# EasyEDA schematic SCH_esp_charge_normal.json
TITLE: Sheet_1; REV: 1.0; Date: 2022-09-16; Sheet: 1/1; Drawn By: elanworld; Company: Your Company
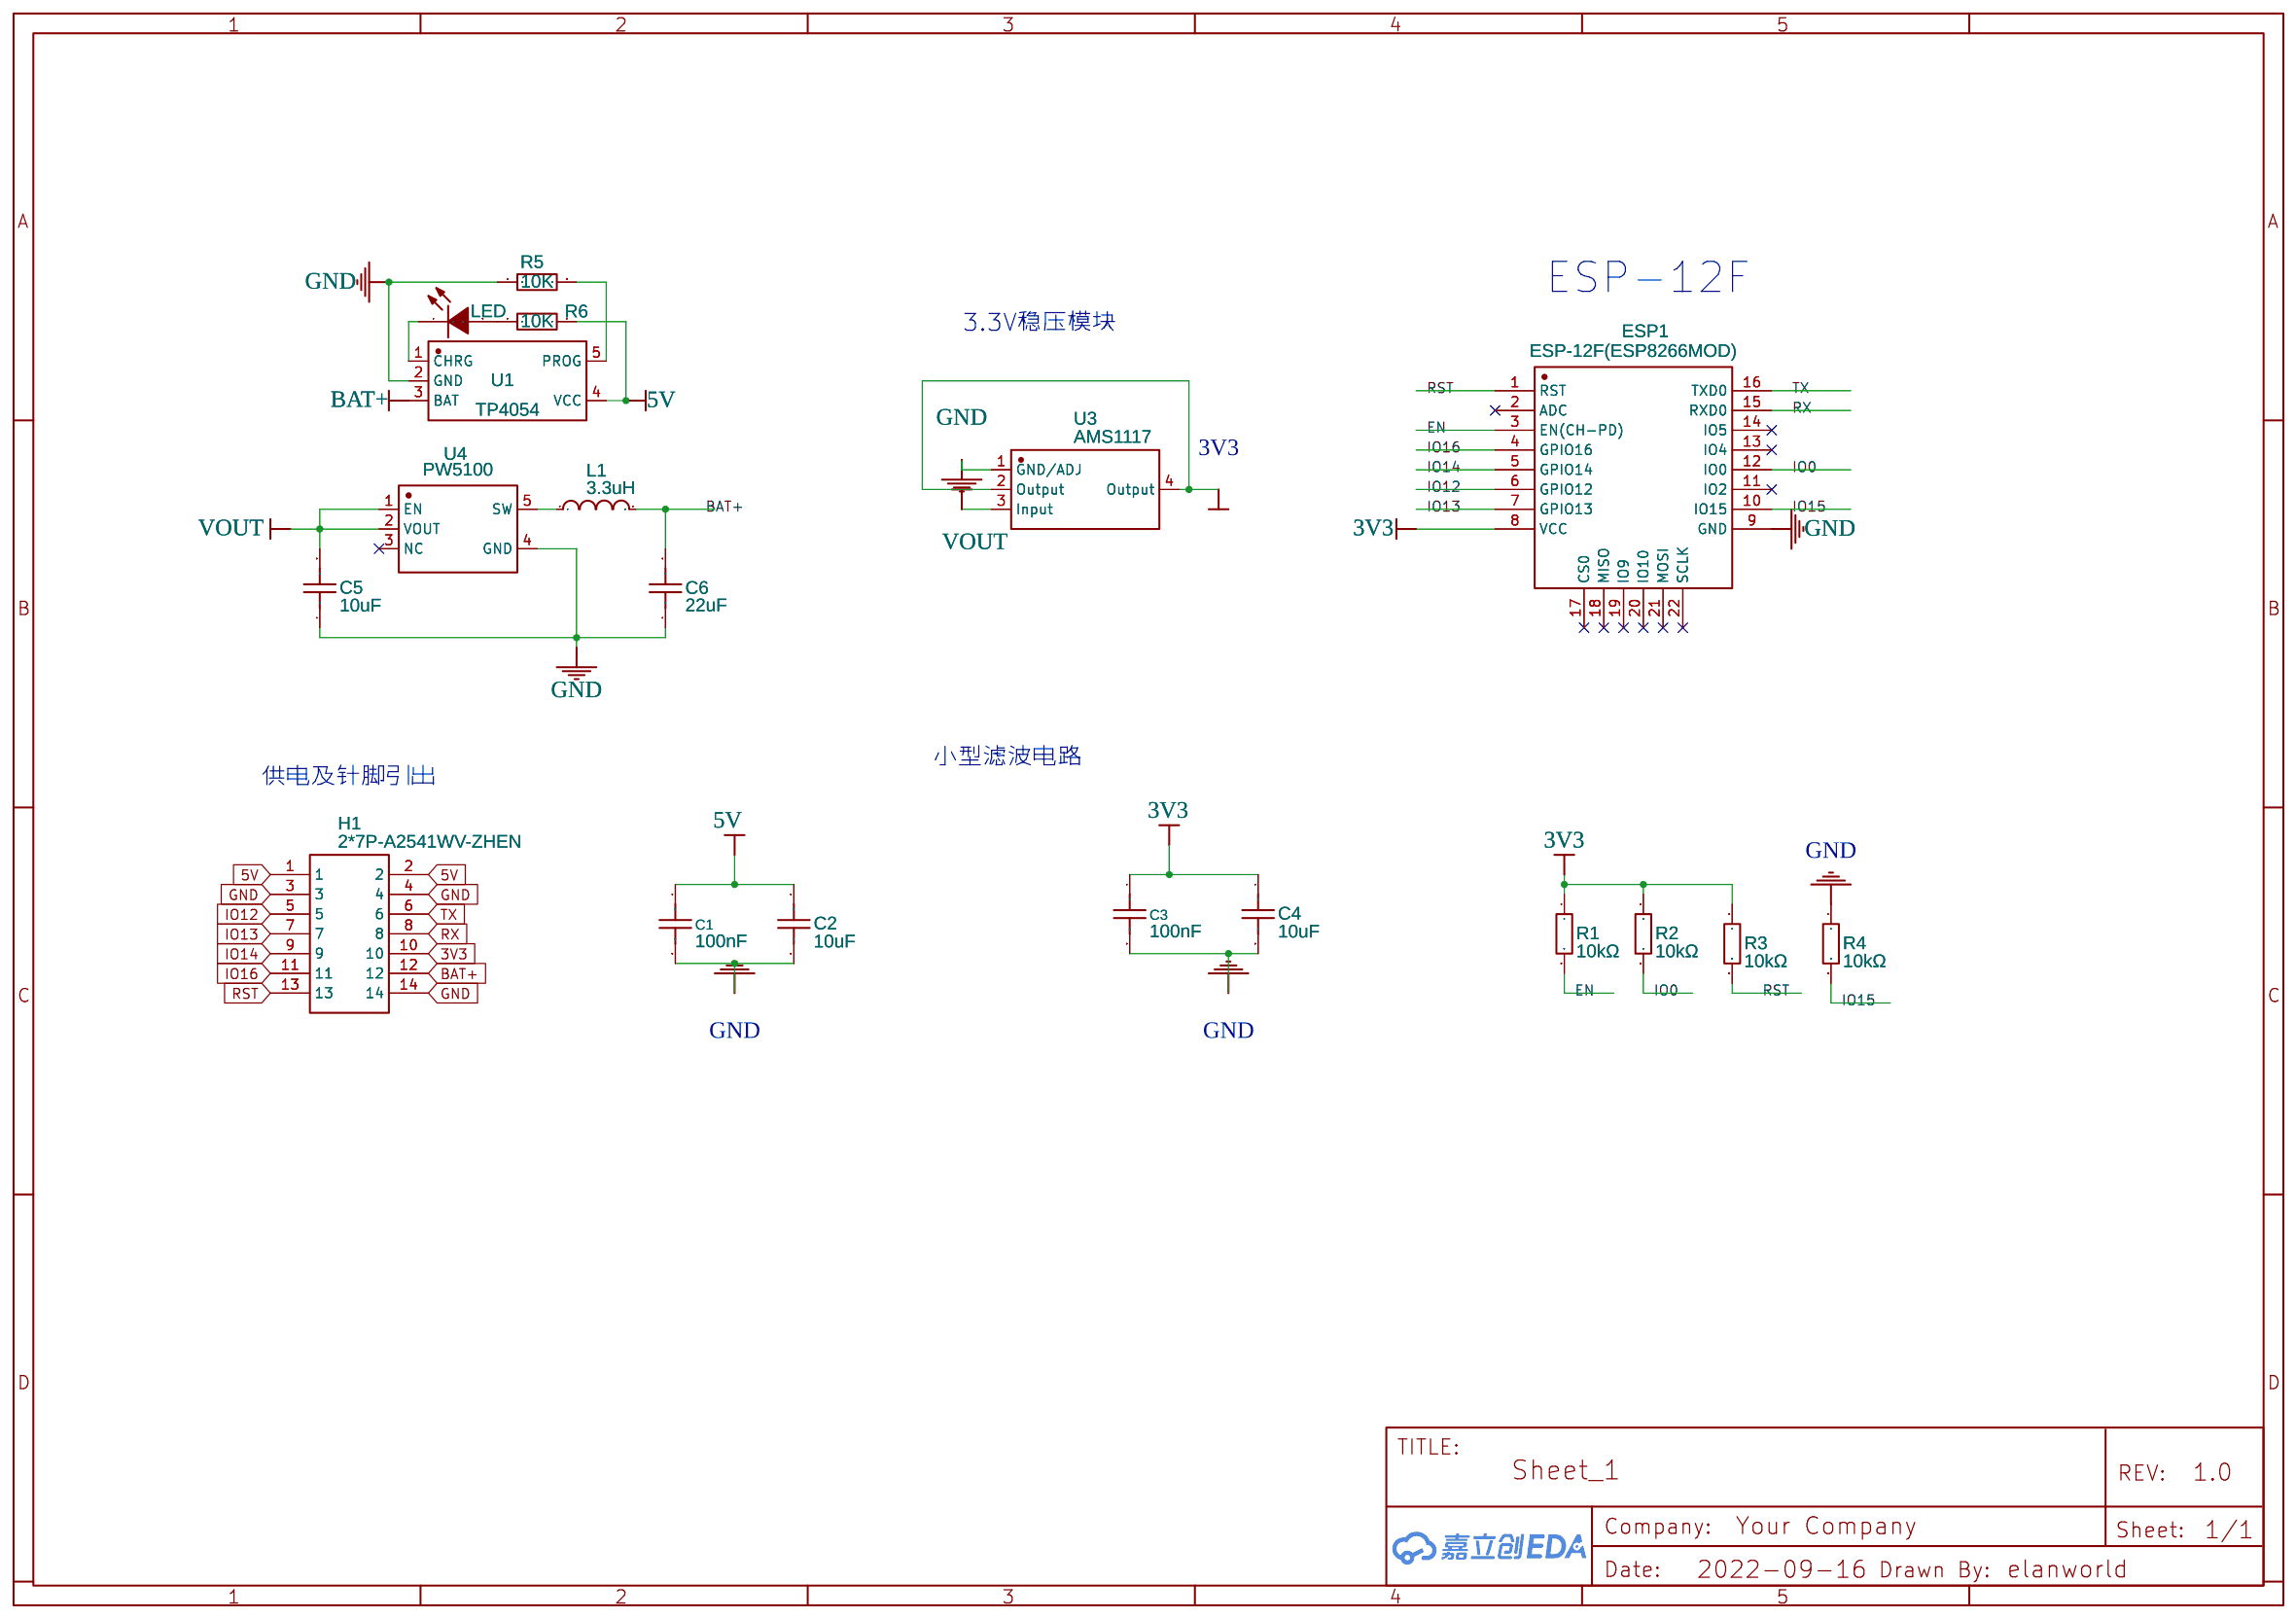
[diagram p0: schematic sheet]

## Parts
C1  100nF  [C0603]
C2  10uF  [C0603]
C3  100nF  [C0603]
C4  10uF  [C0603]
C5  10uF  [C0603]
C6  22uF  [C0603]
ESP1  ESP-12F(ESP8266MOD)  [WIFIM-SMD_ESP-12F-ESP8266MOD]
H1  2*7P-A2541WV-ZHEN  [HDR-TH_14P-P2.54-V-R2-C7-S2.54_A2541WV-2X7P-ZHEN]
L1  3.3uH  [L0805]
LED1  LED  [LED0402-RD]
R1  10kΩ  [R0603]
R2  10kΩ  [R0603]
R3  10kΩ  [R0603]
R4  10kΩ  [R0603]
R5  10K  [R0603]
R6  10K  [R0603]
U1  TP4054  [SOT-23-5_L3.0-W1.7-P0.95-LS2.8-BR]
U3  AMS1117  [SOT-223-4_L6.5-W3.5-P2.30-LS7.0-BR]
U4  PW5100  [SOT-23-5_L3.0-W1.7-P0.95-LS2.8-BR]

## Library data of the parts
C1 C3 = 0805B104K101NT: Supplier: LCSC; Manufacturer: FH; Supplier Part: C89258; JLCPCB Part Class: Extended Part
C2 C4 = C0805X6S106K350NT: Supplier: LCSC; Supplier Part: C2844304; Manufacturer: SANYEAR(叁叶源); link: https://atta.szlcsc.com/upload/public/pdf/source/20200102/C475251_1E30ECAC0E8AE7254982658A02A2D78C.pdf; JLCPCB Part Class: Extended Part; Contributor: lcsc
C5 = CL10A106MA8NRNC: Supplier: LCSC; Manufacturer: SAMSUNG; Supplier Part: C96446; SMT Type: Extend; JLCPCB SMD: Yes
C6 = CL10A226MQ8NRNC: Supplier: LCSC; Manufacturer: SAMSUNG; Supplier Part: C59461; SMT Type: Basic; JLCPCB SMD: Yes
ESP1 = ESP-12F(ESP8266MOD): Supplier: LCSC; Manufacturer: Ai-Thinker; Supplier Part: C82891; JLCPCB Part Class: Extended Part
H1 = 2*7P-A2541WV-ZHEN: Supplier: LCSC; Supplier Part: C225522; Manufacturer: Changjiang Connectors; Manufacturer Part: A2541WV-2x7P; Contributor: zhangqingtao
L1 = LVF252A12-3R3M-N: Supplier: LCSC; Manufacturer: Chilisin; Supplier Part: C142155; JLCPCB SMD: Yes; SMT Type: Extend
LED1 = FC-F1005UGK-520M5: Supplier: LCSC; Manufacturer: NATIONSTAR; Contributor: LCSC; Supplier Part: C130723; JLCPCB Part Class: Extended Part
R1-R4 = QR0805F10KP05: Supplier: LCSC; Supplier Part: C176201; Manufacturer: Ever Ohms Tech; Resistance (Ohms): 10K; Contributor: LCSC; JLCPCB Part Class: Extended Part
R5 R6 = RC0402FR-0710KL: Supplier: LCSC; Manufacturer: YAGEO; Supplier Part: C25744; JLCPCB Part Class: Extended Part
U1 = TP4054: sourceId: dx642CAWU; Contributor: kyle.hu.gz; Supplier: LCSC; Manufacturer: TOPPOWER; Supplier Part: C32574; JLCPCB Part Class: Basic Part
U3 = AMS1117-3.3_C369933: Supplier: LCSC; Supplier Part: C369933; Manufacturer: KEXIN; Manufacturer Part: AMS1117-3.3; Contributor: LCSC; JLCPCB Part Class: Extended Part
U4 = PW5100: Supplier: 平芯微; Manufacturer: PWmicro; Contributor: 小叮智能科技; SMT Type: Extend; JLCPCB SMD: Yes; link: https://www.pwchip.com/product/PW5100-51.html

## Nets
3V3: C3.1 C4.1 ESP1.8(VCC) H1.10 R1.1 R2.1 R3.1 U3.2(Output) U3.4(Output)
5V: C1.1 C2.1 H1.1 H1.2 R6.2 U1.4(VCC)
GND: C1.2 C2.2 C3.2 C4.2 C5.1 C6.1 ESP1.9(GND) H1.3 H1.4 H1.14 R4.1 R5.1 U1.2(GND) U3.1(GND/ADJ) U4.4(GND)
BAT+: C6.2 H1.12 L1.2 U1.3(BAT)
EN: ESP1.3(EN(CH-PD)) R1.2
IO0: ESP1.12(IO0) R2.2
IO12: ESP1.6(GPIO12) H1.5
IO13: ESP1.7(GPIO13) H1.7
IO14: ESP1.5(GPIO14) H1.9
IO15: ESP1.10(IO15) R4.2
IO16: ESP1.4(GPIO16) H1.11
RST: ESP1.1(RST) H1.13 R3.2
RX: ESP1.15(RXD0) H1.8
TX: ESP1.16(TXD0) H1.6
VOUT: C5.2 U3.3(Input) U4.1(EN) U4.2(VOUT)
Net-(L1-1): L1.1 U4.5(SW)
Net-(LED1-1): LED1.1(K) U1.1(CHRG)
Net-(LED1-2): LED1.2(A) R6.1
Net-(R5-2): R5.2 U1.5(PROG)

Not connected (* = marked no-connect by the designer): ESP1 2(ADC)* 11(IO2)* 13(IO4)* 14(IO5)* 17(CS0)* 18(MISO)* 19(IO9)* 20(IO10)* 21(MOSI)* 22(SCLK)*; U4 3(NC)*

## Notes on the sheet
- ESP-12F
- 3.3V稳压模块
- 小型滤波电路
- 供电及针脚引出
